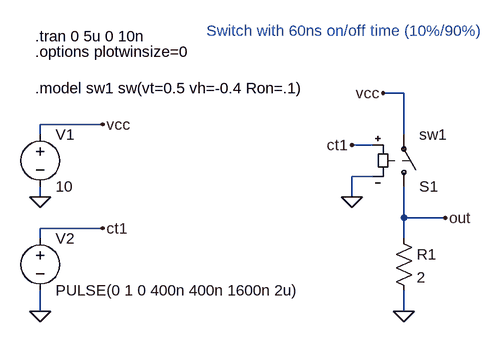
[diagram p0: schematic soft_switch1.asc]
soft_switch1.asc, the LTspice schematic file:
Version 4
SHEET 1 932 680
WIRE 480 -32 448 -32
WIRE 16 16 -80 16
WIRE -80 32 -80 16
WIRE 480 32 480 -32
WIRE 432 48 400 48
WIRE 432 96 400 96
WIRE -80 128 -80 112
WIRE 400 128 400 96
WIRE 480 160 480 112
WIRE 544 160 480 160
WIRE 16 176 -80 176
WIRE -80 192 -80 176
WIRE 480 192 480 160
WIRE -80 304 -80 272
WIRE 480 304 480 272
FLAG 480 304 0
FLAG 400 128 0
FLAG -80 304 0
FLAG -80 128 0
FLAG 544 160 out
FLAG 16 176 ct1
FLAG 16 16 vcc
FLAG 448 -32 vcc
FLAG 400 48 ct1
SYMBOL voltage -80 16 R0
WINDOW 123 0 0 Left 0
WINDOW 39 0 0 Left 0
SYMATTR InstName V1
SYMATTR Value 10
SYMBOL res 464 176 R0
SYMATTR InstName R1
SYMATTR Value 2
SYMBOL sw 480 128 M180
SYMATTR InstName S1
SYMATTR Value sw1
SYMBOL voltage -80 176 R0
WINDOW 123 0 0 Left 0
WINDOW 39 0 0 Left 0
SYMATTR InstName V2
SYMATTR Value PULSE(0 1 0 400n 400n 1600n 2u)
TEXT -88 -120 Left 0 !.tran 0 5u 0 10n
TEXT -88 -40 Left 0 !.model sw1 sw(vt=0.5 vh=-0.4 Ron=.1)
TEXT -88 -96 Left 0 !.options plotwinsize=0
TEXT 176 -128 Left 0 ;Switch with 60ns on/off time (10%/90%)

The netlist it stands for:
* soft_switch1.asc
V1 vcc 0 10
R1 out 0 2
S1 out vcc ct1 0 sw1
V2 ct1 0 PULSE(0 1 0 400n 400n 1600n 2u)
.tran 0 5u 0 10n
.model sw1 sw(vt=0.5 vh=-0.4 Ron=.1)
.options plotwinsize=0
* Switch with 60ns on/off time (10%/90%)
.backanno
.end